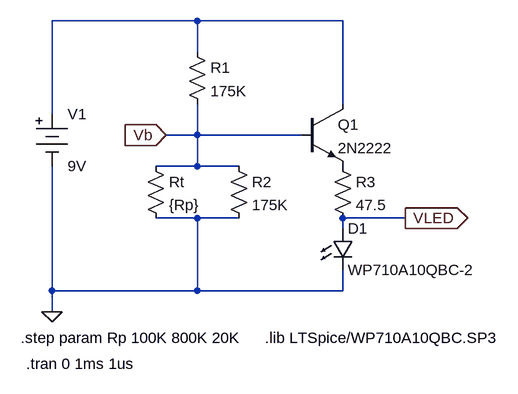
[diagram p0: schematic Thermistor LED circuit.asc]
Thermistor LED circuit.asc, the LTspice schematic file:
Version 4
SHEET 1 888 680
WIRE 432 112 208 112
WIRE 656 112 432 112
WIRE 432 160 432 112
WIRE 656 240 656 112
WIRE 208 256 208 112
WIRE 432 288 432 240
WIRE 432 288 384 288
WIRE 592 288 432 288
WIRE 432 336 432 288
WIRE 432 336 368 336
WIRE 496 336 432 336
WIRE 432 416 368 416
WIRE 496 416 432 416
WIRE 752 416 656 416
WIRE 656 432 656 416
WIRE 208 528 208 336
WIRE 432 528 432 416
WIRE 432 528 208 528
WIRE 656 528 656 496
WIRE 656 528 432 528
WIRE 208 560 208 528
FLAG 208 560 0
FLAG 384 288 Vb
IOPIN 384 288 In
FLAG 752 416 VLED
IOPIN 752 416 Out
SYMBOL Misc/battery 208 240 R0
SYMATTR InstName V1
SYMATTR Value 9V
SYMBOL res 416 144 R0
SYMATTR InstName R1
SYMATTR Value 175K
SYMBOL res 640 320 R0
SYMATTR InstName R3
SYMATTR Value 47.5
SYMBOL res 352 320 R0
SYMATTR InstName Rt
SYMATTR Value {Rp}
SYMBOL res 480 320 R0
SYMATTR InstName R2
SYMATTR Value 175K
SYMBOL LED 640 432 R0
SYMATTR InstName D1
SYMATTR Value WP710A10QBC-2
SYMBOL npn 592 240 R0
SYMATTR InstName Q1
SYMATTR Value 2N2222
TEXT 536 600 Left 2 !.lib LTSpice/WP710A10QBC.SP3
TEXT 160 600 Left 2 !.step param Rp 100K 800K 20K
TEXT 168 640 Left 2 !.tran 0 1ms 1us

The netlist it stands for:
* Thermistor LED circuit.asc
V1 N001 0 9V
R1 N001 Vb 175K
R3 P001 VLED 47.5
Rt Vb 0 {Rp}
R2 Vb 0 175K
D1 VLED 0 WP710A10QBC-2
Q1 N001 Vb P001 0 2N2222
.model D D
.lib standard.dio
.model NPN NPN
.model PNP PNP
.lib standard.bjt
.lib LTSpice/WP710A10QBC.SP3
.step param Rp 100K 800K 20K
.tran 0 1ms 1us
.backanno
.end